# EAGLE schematic TWV (EAGLE 9.6.2)
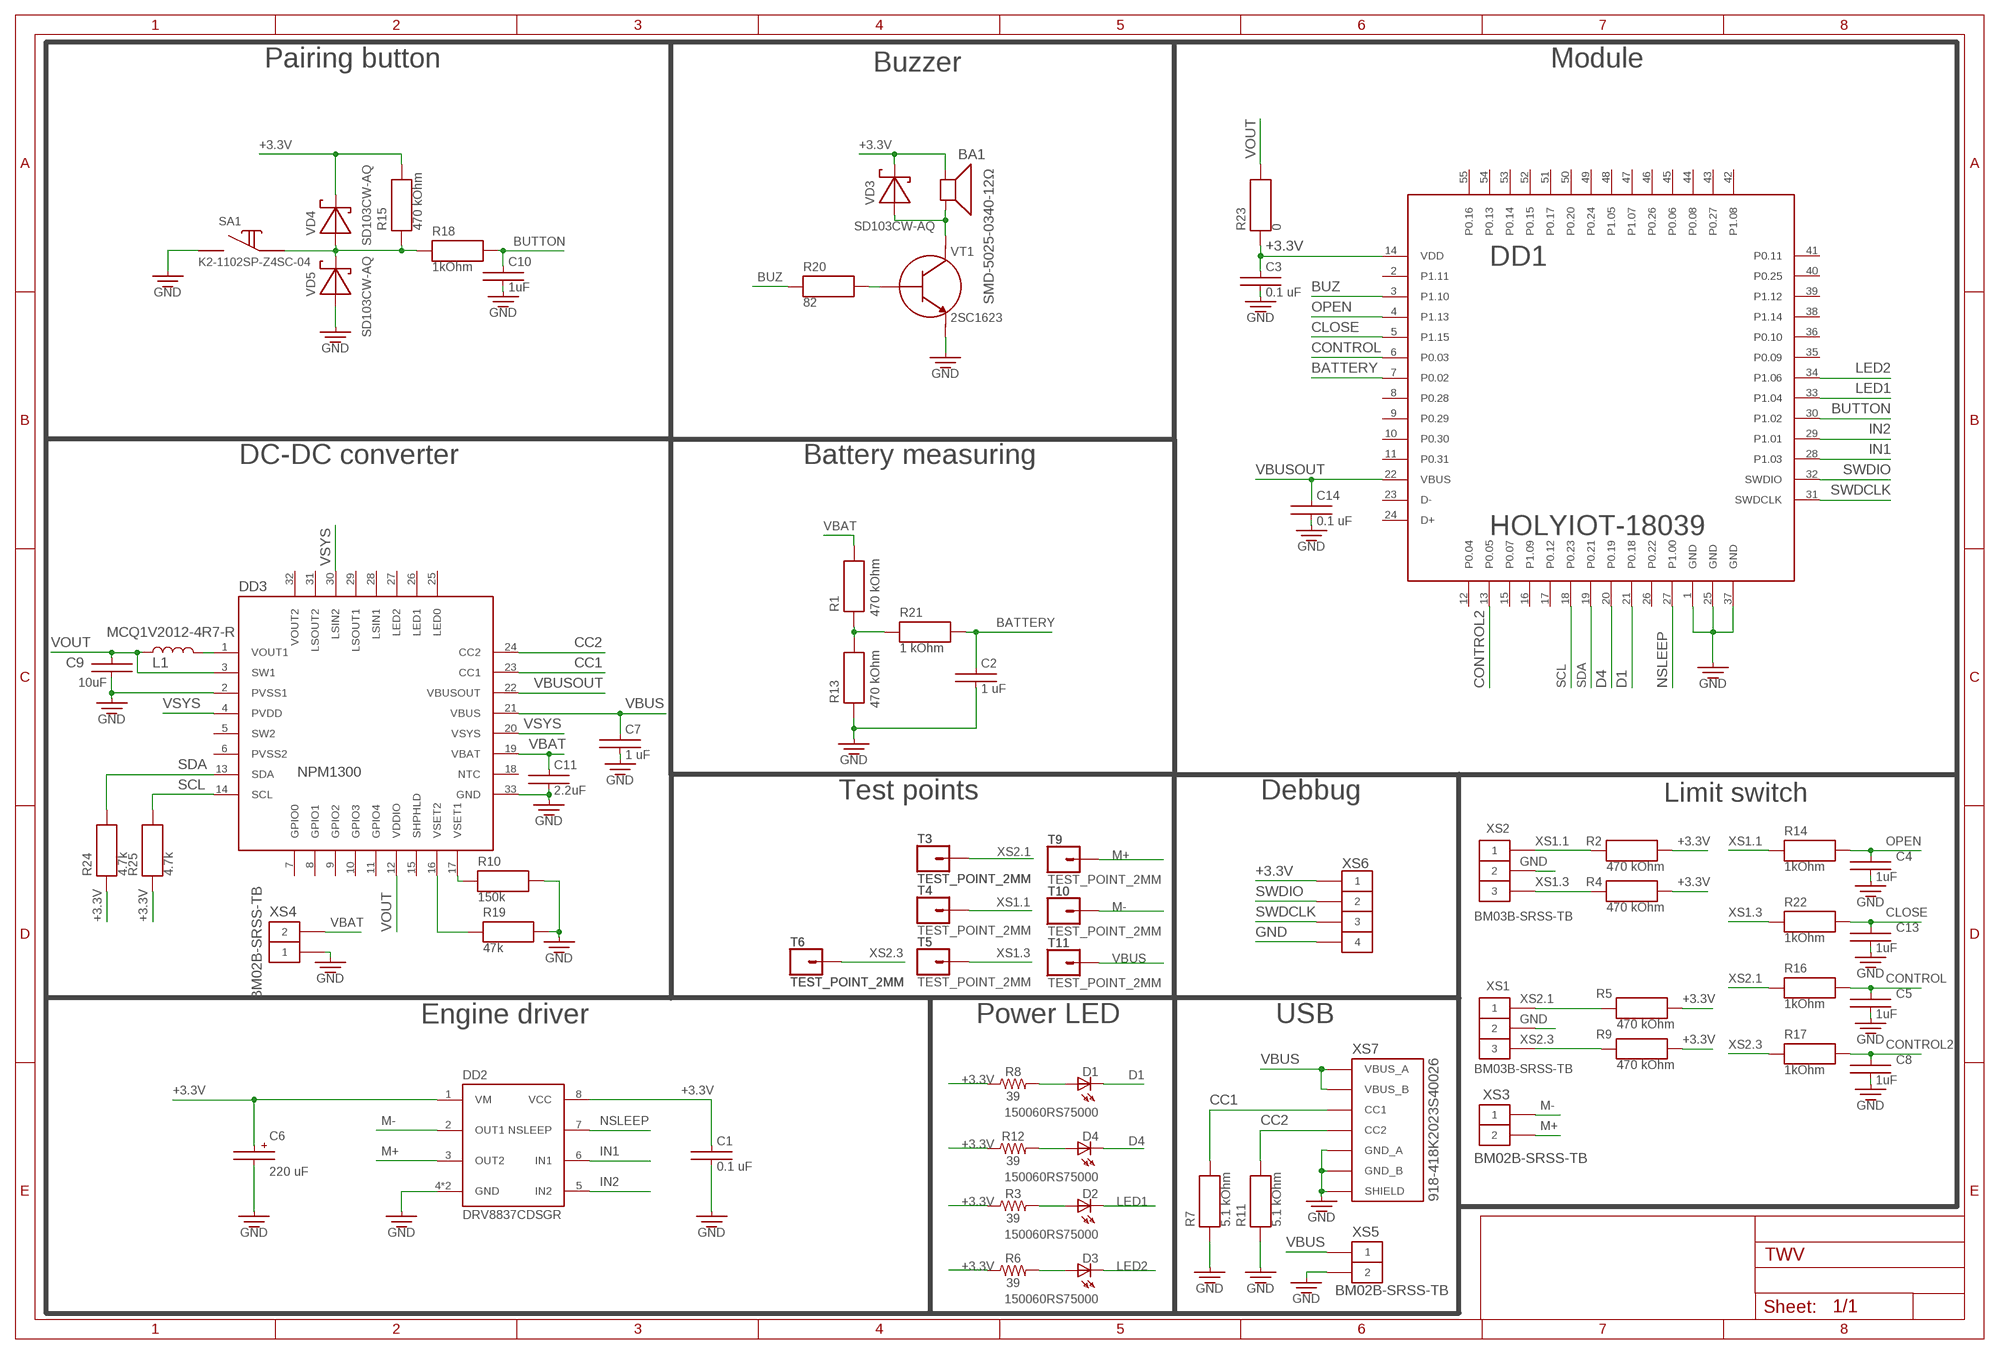
[diagram p0: schematic, sheet 1]

## Parts
BA1  SMD-5025-0340-12Ω  [SMD-5025-0340-12Ω]
C1  0.1 uF  CAPACITOR-0603  [0603]
C2  1 uF  CAPACITOR-0603  [0603]
C3  0.1 uF  CAPACITOR-0603  [0603]
C4  1uF  CAPACITOR-0603  [0603]
C5  1uF  CAPACITOR-0603  [0603]
C6  220 uF  ALUM_CAP_SMD-6.3X8  [6.3X8]
C7  1 uF  CAPACITOR-0603  [0603]
C8  1uF  CAPACITOR-0603  [0603]
C9  10uF  CAPACITOR-0603  [0603]
C10  1uF  CAPACITOR-0603  [0603]
C11  2.2uF  CAPACITOR-0603  [0603]
C13  1uF  CAPACITOR-0603  [0603]
C14  0.1 uF  CAPACITOR-0603  [0603]
D1  150060RS75000  [0603]
D2  150060RS75000  [0603]
D3  150060RS75000  [0603]
D4  150060RS75000  [0603]
DD1  HOLYIOT-18039  [HOLYIOT-18039]
DD2  DRV8837CDSGR  [WSON-8]
DD3  NPM1300  [QFN32-5X5MM]
L1  MCQ1V2012-4R7-R  [0805]
R1  470 kOhm  RESISTOR-0603  [0603]
R2  470 kOhm  RESISTOR-0603  [0603]
R3  39  RC0603JR-0739RL  [RES0603]
R4  470 kOhm  RESISTOR-0603  [0603]
R5  470 kOhm  RESISTOR-0603  [0603]
R6  39  RC0603JR-0739RL  [RES0603]
R7  5.1 kOhm  RESISTOR-0603  [0603]
R8  39  RC0603JR-0739RL  [RES0603]
R9  470 kOhm  RESISTOR-0603  [0603]
R10  150k  RESISTOR-0603  [0603]
R11  5.1 kOhm  RESISTOR-0603  [0603]
R12  39  RC0603JR-0739RL  [RES0603]
R13  470 kOhm  RESISTOR-0603  [0603]
R14  1kOhm  RESISTOR-0603  [0603]
R15  470 kOhm  RESISTOR-0603  [0603]
R16  1kOhm  RESISTOR-0603  [0603]
R17  1kOhm  RESISTOR-0603  [0603]
R18  1kOhm  RESISTOR-0603  [0603]
R19  47k  RESISTOR-0603  [0603]
R20  82  RESISTOR-0603  [0603]
R21  1 kOhm  RESISTOR-0603  [0603]
R22  1kOhm  RESISTOR-0603  [0603]
R23  0  RESISTOR-0805  [0805]
R24  4.7k  RESISTOR-0603  [0603]
R25  4.7k  RESISTOR-0603  [0603]
SA1  K2-1102SP-Z4SC-04  [K2-1102SP-Z4SC-04]
T3  TEST_POINT_2MM  [TEST_POINT_2MM]
T4  TEST_POINT_2MM  [TEST_POINT_2MM]
T5  TEST_POINT_2MM  [TEST_POINT_2MM]
T6  TEST_POINT_2MM  [TEST_POINT_2MM]
T9  TEST_POINT_2MM  [TEST_POINT_2MM]
T10  TEST_POINT_2MM  [TEST_POINT_2MM]
T11  TEST_POINT_2MM  [TEST_POINT_2MM]
VD3  SD103CW-AQ  [SOD-123F]
VD4  SD103CW-AQ  [SOD-123F]
VD5  SD103CW-AQ  [SOD-123F]
VT1  2SC1623  [SOT-23]
XS1  BM03B-SRSS-TB  [BM03B-SRSS-TB]
XS2  BM03B-SRSS-TB  [BM03B-SRSS-TB]
XS3  BM02B-SRSS-TB  [BM02B-SRSS-TB]
XS4  BM02B-SRSS-TB  [BM02B-SRSS-TB]
XS5  BM02B-SRSS-TB  [BM02B-SRSS-TB]
XS6  TH1X4-2.54MM  [TH1X4-2.54MM]
XS7  918-418K2023S40026  [918-418K2023S40026]

## Nets
+3.3V: BA1.+ C1.1 C3.1 C6.+ DD1.14(VDD) DD2.1(VM) DD2.8(VCC) R2.2 R3.1 R4.2 R5.2 R6.1 R8.1 R9.2 R12.1 R15.2 R23.1 R24.1 R25.1 VD3.C VD4.C XS6.1
BATTERY: C2.1 DD1.7(P0.02) R21.2
BUTTON: C10.1 DD1.30(P1.02) R18.2
BUZ: DD1.3(P1.10) R20.1
CC1: DD3.23(CC1) R7.2 XS7.A5(CC1)
CC2: DD3.24(CC2) R11.2 XS7.B5(CC2)
CLOSE: C13.1 DD1.5(P1.15) R22.2
CONTROL: C5.1 DD1.6(P0.03) R16.2
CONTROL2: C8.1 DD1.13(P0.05) R17.2
D1: D1.C(K) DD1.21(P0.18)
D4: D4.C(K) DD1.20(P0.19)
GND: C1.2 C2.2 C3.2 C4.2 C5.2 C6.- C7.2 C8.2 C9.2 C10.2 C11.2 C13.2 C14.2 DD1.1(GND) DD1.25(GND) DD1.37(GND) DD2.4(GND) DD2.GND DD3.2(PVSS1) DD3.33(GND) R7.1 R10.2 R11.1 R13.1 R19.2 SA1.1 SA1.4 VD5.A VT1.2(E) XS1.2 XS2.2 XS4.1 XS5.2 XS6.4 XS7.A12(GND_A) XS7.B12(GND_B) XS7.SH1(SHIELD) XS7.SH2(SHIELD) XS7.SH3(SHIELD) XS7.SH4(SHIELD)
IN1: DD1.28(P1.03) DD2.6(IN1)
IN2: DD1.29(P1.01) DD2.5(IN2)
LED1: D2.C(K) DD1.33(P1.04)
LED2: D3.C(K) DD1.34(P1.06)
M+: DD2.3(OUT2) T9.1 XS3.2
M-: DD2.2(OUT1) T10.1 XS3.1
N1: DD3.1(VOUT1) L1.P$2
N$1: R15.1 R18.1 SA1.2 SA1.3 VD4.A VD5.C
N$3: DD3.17(VSET1) R10.1
N$4: DD3.16(VSET2) R19.1
N$5: BA1.- VD3.A VT1.3(C)
N$6: D1.A R8.2
N$9: D2.A R3.2
N$10: D3.A R6.2
N$11: R20.2 VT1.1(B)
N$13: D4.A R12.2
N$18: R1.1 R13.2 R21.1
NSLEEP: DD1.27(P1.00) DD2.7(NSLEEP)
OPEN: C4.1 DD1.4(P1.13) R14.2
SCL: DD1.18(P0.23) DD3.14(SCL) R25.2
SDA: DD1.19(P0.21) DD3.13(SDA) R24.2
SWDCLK: DD1.31(SWDCLK) XS6.3
SWDIO: DD1.32(SWDIO) XS6.2
VBAT: C11.1 DD3.19(VBAT) R1.2 XS4.2
VBUS: C7.1 DD3.21(VBUS) T11.1 XS5.1 XS7.A9(VBUS_A) XS7.B9(VBUS_B)
VBUSOUT: C14.1 DD1.22(VBUS) DD3.22(VBUSOUT)
VOUT: C9.1 DD3.3(SW1) DD3.12(VDDIO) L1.P$1 R23.2
VSYS: DD3.4(PVDD) DD3.20(VSYS) DD3.30(LSIN2)
XS1.1: R2.1 R14.1 T4.1 XS2.1
XS1.3: R4.1 R22.1 T5.1 XS2.3
XS2.1: R5.1 R16.1 T3.1 XS1.1
XS2.3: R9.1 R17.1 T6.1 XS1.3
Unconnected: DD1.2(P1.11) DD1.8(P0.28) DD1.9(P0.29) DD1.10(P0.30) DD1.11(P0.31) DD1.12(P0.04) DD1.15(P0.07) DD1.16(P1.09) DD1.17(P0.12) DD1.23(D-) DD1.24(D+) DD1.26(P0.22) DD1.35(P0.09) DD1.36(P0.10) DD1.38(P1.14) DD1.39(P1.12) DD1.40(P0.25) DD1.41(P0.11) DD1.42(P1.08) DD1.43(P0.27) DD1.44(P0.08) DD1.45(P0.06) DD1.46(P0.26) DD1.47(P1.07) DD1.48(P1.05) DD1.49(P0.24) DD1.50(P0.20) DD1.51(P0.17) DD1.52(P0.15) DD1.53(P0.14) DD1.54(P0.13) DD1.55(P0.16) DD3.5(SW2) DD3.6(PVSS2) DD3.7(GPIO0) DD3.8(GPIO1) DD3.9(GPIO2) DD3.10(GPIO3) DD3.11(GPIO4) DD3.15(SHPHLD) DD3.18(NTC) DD3.25(LED0) DD3.26(LED1) DD3.27(LED2) DD3.28(LSIN1) DD3.29(LSOUT1) DD3.31(LSOUT2) DD3.32(VOUT2)

## Notes on the sheet
- Pairing button | Buzzer | Module
- DC-DC converter | Battery measuring
- Test points | Debbug | Limit switch
- Engine driver | Power LED | USB

## Library data of the parts
BA1 = Buzzers:SMD-5025-0340-12Ω
C1-C5 C7-C11 C13 C14 = Capacitor:CAPACITOR
C6 = Capacitor:ALUM_CAP_SMD: ALUMINUM ELECTROLYTIC CAPACITORS
D1-D4 = VDD-LED:150060RS75000; CATEGORY: LED; DESCRIPTION: LED RED CLEAR 0603 SMD; MANUFACTURER: Würth Elektronik; MOUNTING_TYPE: SMD; MPN: 150060RS75000; PACKAGE: 0603; URL: https://www.we-online.de/katalog/datasheet/150060RS75000.pdf
DD1 = Modules:HOLYIOT-18039
DD2 = Driver:DRV8837CDSGR
DD3 = Power-IC:NPM1300
L1 = Inductors:MCQ1V2012-4R7-R
R1 R2 R4 R5 R7 R9-R11 R13-R25 = Resistors:RESISTOR
R3 R6 R8 R12 = VDD-Resistors:RC0603JR-0739RL; CATEGORY: Chip Resistor; DESCRIPTION: RES SMD 39 OHM 5% 1/10W 0603; MANUFACTURER: Yageo; MOUNTING_TYPE: SMD; MPN: RC0603JR-0739RL; PACKAGE: 0603; URL: https://www.digikey.com/product-detail/en/yageo/RC0603JR-0739RL/311-39GRCT-ND/729726
SA1 = Buttons:K2-1102SP-Z4SC-04
T3-T6 T9-T11 = VDD-Connectors:TEST_POINT_2MM
VD3-VD5 = Diode:SD103CW-AQ
VT1 = Transistor:2SC1623
XS1 XS2 = Connectors:BM03B-SRSS-TB
XS3-XS5 = Connectors:BM02B-SRSS-TB
XS6 = TestPoint:TH1X4-2.54MM
XS7 = USB:918-418K2023S40026; JLCPCB: C2763104

## Net classes
0 default: width 0.2 mm, drill 0.3 mm, clearance 0.2 mm